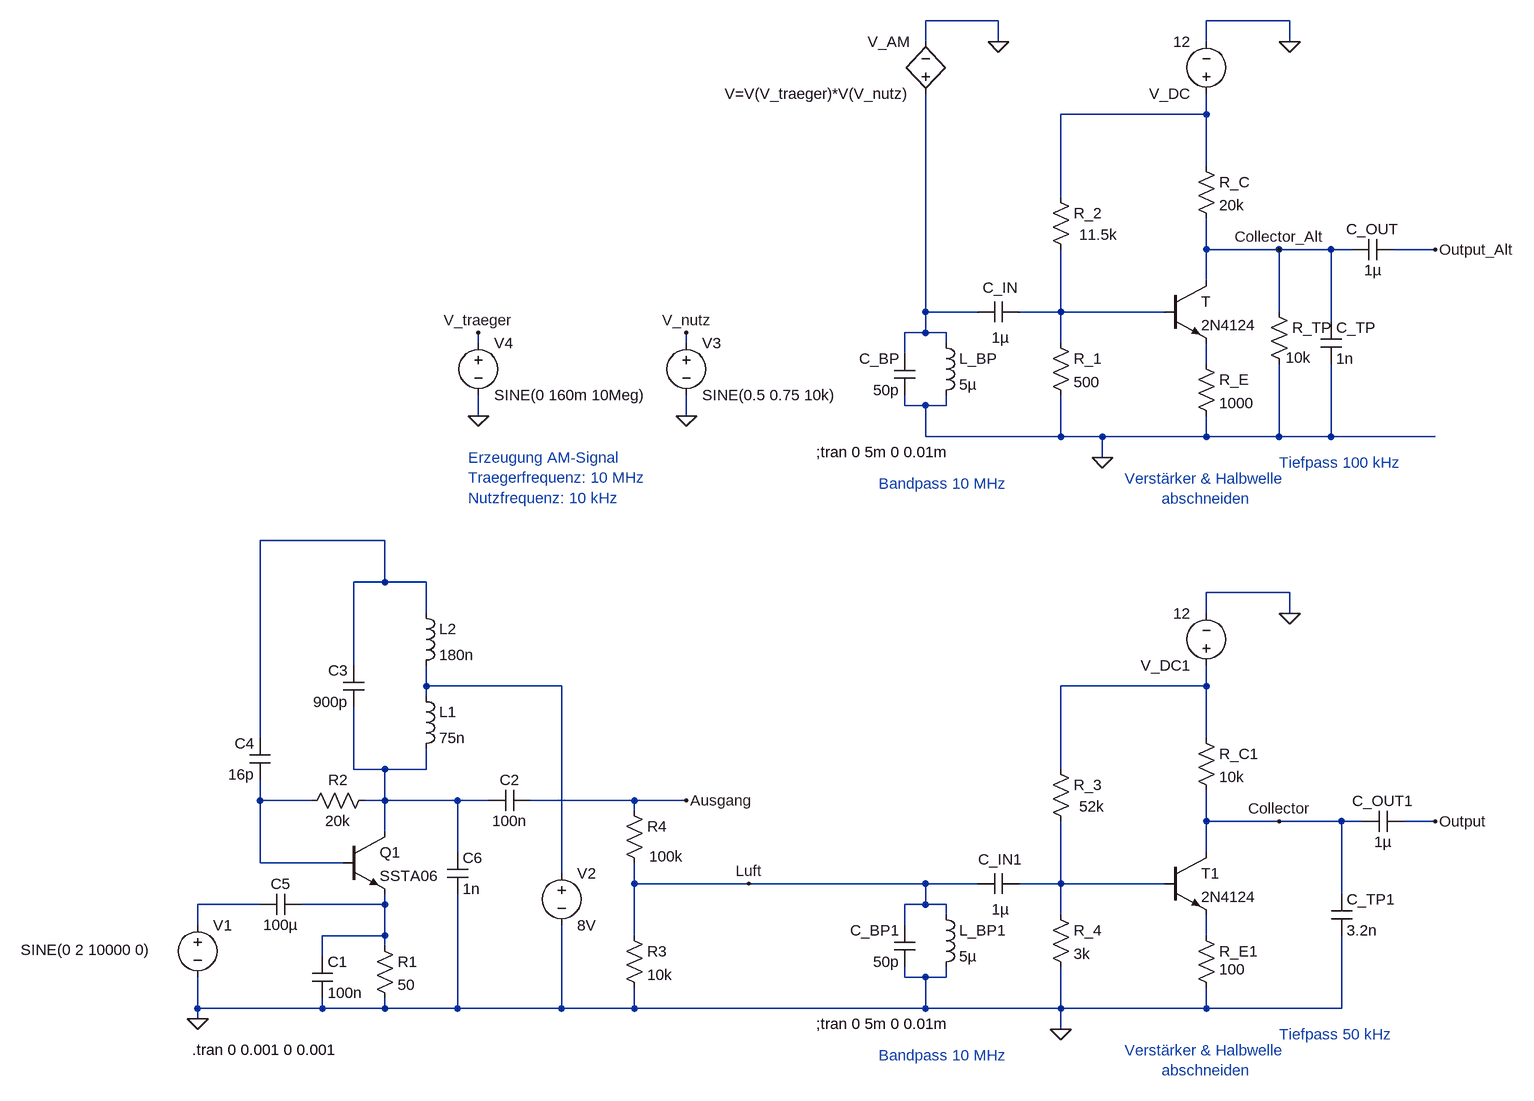
[diagram p0: schematic Empfaenger_Sender_AM_Modulation.asc]
Empfaenger_Sender_AM_Modulation.asc, the LTspice schematic file:
Version 4
SHEET 1 968 1520
WIRE -96 -304 -208 -304
WIRE 352 -304 224 -304
WIRE -208 -272 -208 -304
WIRE -96 -272 -96 -304
WIRE 224 -272 224 -304
WIRE 352 -272 352 -304
WIRE 224 -160 224 -192
WIRE 224 -160 0 -160
WIRE 224 -80 224 -160
WIRE 0 -32 0 -160
WIRE 224 48 224 0
WIRE 336 48 224 48
WIRE 416 48 336 48
WIRE 448 48 416 48
WIRE 576 48 512 48
WIRE 224 96 224 48
WIRE -208 144 -208 -192
WIRE -128 144 -208 144
WIRE 0 144 0 48
WIRE 0 144 -64 144
WIRE 160 144 0 144
WIRE 336 144 336 48
WIRE 416 160 416 48
WIRE -208 176 -208 144
WIRE -208 176 -240 176
WIRE -176 176 -208 176
WIRE -896 192 -896 176
WIRE -576 192 -576 176
WIRE -176 192 -176 176
WIRE 0 192 0 144
WIRE -240 208 -240 176
WIRE 224 224 224 192
WIRE -240 288 -240 272
WIRE -208 288 -240 288
WIRE -176 288 -176 272
WIRE -176 288 -208 288
WIRE -896 304 -896 272
WIRE -576 304 -576 272
WIRE -208 336 -208 288
WIRE 0 336 0 272
WIRE 0 336 -208 336
WIRE 64 336 0 336
WIRE 224 336 224 304
WIRE 224 336 64 336
WIRE 336 336 336 224
WIRE 336 336 224 336
WIRE 416 336 416 224
WIRE 416 336 336 336
WIRE 576 336 416 336
WIRE 64 368 64 336
WIRE -1040 496 -1232 496
WIRE -1040 560 -1040 496
WIRE -1040 560 -1088 560
WIRE -976 560 -1040 560
WIRE 352 576 224 576
WIRE -976 608 -976 560
WIRE 224 608 224 576
WIRE 352 608 352 576
WIRE -1088 688 -1088 560
WIRE -976 720 -976 688
WIRE -768 720 -976 720
WIRE 224 720 224 688
WIRE 224 720 0 720
WIRE -976 736 -976 720
WIRE -1232 800 -1232 496
WIRE 224 800 224 720
WIRE -1088 848 -1088 752
WIRE -1040 848 -1088 848
WIRE -976 848 -976 816
WIRE -976 848 -1040 848
WIRE 0 848 0 720
WIRE -1232 896 -1232 864
WIRE -1152 896 -1232 896
WIRE -1040 896 -1040 848
WIRE -1040 896 -1072 896
WIRE -928 896 -1040 896
WIRE -880 896 -928 896
WIRE -656 896 -816 896
WIRE -576 896 -656 896
WIRE -656 912 -656 896
WIRE 224 928 224 880
WIRE 336 928 224 928
WIRE 432 928 336 928
WIRE 464 928 432 928
WIRE 576 928 528 928
WIRE -1040 944 -1040 896
WIRE -928 976 -928 896
WIRE 224 976 224 928
WIRE -1232 992 -1232 896
WIRE -1104 992 -1232 992
WIRE -768 1008 -768 720
WIRE -656 1024 -656 992
WIRE -480 1024 -656 1024
WIRE -208 1024 -480 1024
WIRE -128 1024 -208 1024
WIRE 0 1024 0 928
WIRE 0 1024 -64 1024
WIRE 160 1024 0 1024
WIRE 432 1040 432 928
WIRE -1232 1056 -1328 1056
WIRE -1040 1056 -1040 1040
WIRE -1040 1056 -1168 1056
WIRE -208 1056 -208 1024
WIRE -208 1056 -240 1056
WIRE -176 1056 -208 1056
WIRE -176 1072 -176 1056
WIRE 0 1072 0 1024
WIRE -1328 1088 -1328 1056
WIRE -240 1088 -240 1056
WIRE -1040 1104 -1040 1056
WIRE -1040 1104 -1136 1104
WIRE -656 1104 -656 1024
WIRE 224 1104 224 1072
WIRE -1040 1120 -1040 1104
WIRE -1136 1136 -1136 1104
WIRE -240 1168 -240 1152
WIRE -208 1168 -240 1168
WIRE -176 1168 -176 1152
WIRE -176 1168 -208 1168
WIRE -1328 1216 -1328 1168
WIRE -1136 1216 -1136 1200
WIRE -1136 1216 -1328 1216
WIRE -1040 1216 -1040 1200
WIRE -1040 1216 -1136 1216
WIRE -928 1216 -928 1040
WIRE -928 1216 -1040 1216
WIRE -768 1216 -768 1088
WIRE -768 1216 -928 1216
WIRE -656 1216 -656 1184
WIRE -656 1216 -768 1216
WIRE -208 1216 -208 1168
WIRE -208 1216 -656 1216
WIRE 0 1216 0 1152
WIRE 0 1216 -208 1216
WIRE 224 1216 224 1184
WIRE 224 1216 0 1216
WIRE 432 1216 432 1104
WIRE 432 1216 224 1216
WIRE -1328 1232 -1328 1216
WIRE 0 1248 0 1216
FLAG 64 368 0
FLAG 352 -272 0
FLAG -96 -272 0
FLAG -576 304 0
FLAG -896 304 0
FLAG -896 176 V_traeger
FLAG -576 176 V_nutz
FLAG 576 48 Output_Alt
FLAG 336 48 Collector_Alt
FLAG 0 1248 0
FLAG 352 608 0
FLAG 576 928 Output
FLAG 336 928 Collector
FLAG -1328 1232 0
FLAG -576 896 Ausgang
FLAG -480 1024 Luft
SYMBOL cap -224 272 R180
WINDOW 0 24 56 Left 2
WINDOW 3 24 8 Left 2
SYMATTR InstName C_BP
SYMATTR Value 50p
SYMBOL cap -128 160 R270
WINDOW 0 38 35 VTop 2
WINDOW 3 -8 35 VBottom 2
SYMATTR InstName C_IN
SYMATTR Value 1µ
SYMBOL res 208 -96 R0
SYMATTR InstName R_C
SYMATTR Value 20k
SYMBOL ind -192 176 R0
SYMATTR InstName L_BP
SYMATTR Value 5µ
SYMBOL npn 160 96 R0
SYMATTR InstName T
SYMATTR Value 2N4124
SYMBOL voltage 224 -176 R180
WINDOW 123 0 0 Left 0
WINDOW 39 0 0 Left 0
SYMATTR InstName V_DC
SYMATTR Value 12
SYMBOL res -16 -48 R0
WINDOW 3 44 73 Left 2
SYMATTR Value 11.5k
SYMATTR InstName R_2
SYMBOL res -16 176 R0
SYMATTR InstName R_1
SYMATTR Value 500
SYMBOL cap 512 32 R90
WINDOW 0 0 32 VBottom 2
WINDOW 3 32 32 VTop 2
SYMATTR InstName C_OUT
SYMATTR Value 1µ
SYMATTR SpiceLine V=0 Irms=0 Rser=0 Lser=0
SYMBOL voltage -576 176 R0
WINDOW 123 0 0 Left 0
WINDOW 39 0 0 Left 0
SYMATTR InstName V3
SYMATTR Value SINE(0.5 0.75 10k)
SYMBOL voltage -896 176 R0
WINDOW 123 0 0 Left 0
WINDOW 39 0 0 Left 0
SYMATTR InstName V4
SYMATTR Value SINE(0 160m 10Meg)
SYMBOL bv -208 -176 R180
WINDOW 0 24 96 Left 2
WINDOW 3 24 16 Left 2
SYMATTR InstName V_AM
SYMATTR Value V=V(V_traeger)*V(V_nutz)
SYMBOL cap 400 160 R0
SYMATTR InstName C_TP
SYMATTR Value 1n
SYMBOL res 320 128 R0
WINDOW 3 26 86 Left 2
SYMATTR Value 10k
SYMATTR InstName R_TP
SYMBOL res 208 208 R0
SYMATTR InstName R_E
SYMATTR Value 1000
SYMBOL cap -224 1152 R180
WINDOW 0 24 56 Left 2
WINDOW 3 24 8 Left 2
SYMATTR InstName C_BP1
SYMATTR Value 50p
SYMBOL cap -128 1040 R270
WINDOW 0 38 35 VTop 2
WINDOW 3 -8 35 VBottom 2
SYMATTR InstName C_IN1
SYMATTR Value 1µ
SYMBOL res 208 784 R0
SYMATTR InstName R_C1
SYMATTR Value 10k
SYMBOL ind -192 1056 R0
SYMATTR InstName L_BP1
SYMATTR Value 5µ
SYMBOL npn 160 976 R0
SYMATTR InstName T1
SYMATTR Value 2N4124
SYMBOL voltage 224 704 R180
WINDOW 123 0 0 Left 0
WINDOW 39 0 0 Left 0
SYMATTR InstName V_DC1
SYMATTR Value 12
SYMBOL res -16 832 R0
WINDOW 3 44 73 Left 2
SYMATTR Value 52k
SYMATTR InstName R_3
SYMBOL res -16 1056 R0
SYMATTR InstName R_4
SYMATTR Value 3k
SYMBOL cap 528 912 R90
WINDOW 0 0 32 VBottom 2
WINDOW 3 32 32 VTop 2
SYMATTR InstName C_OUT1
SYMATTR Value 1µ
SYMATTR SpiceLine V=0 Irms=0 Rser=0 Lser=0
SYMBOL cap 416 1040 R0
SYMATTR InstName C_TP1
SYMATTR Value 3.2n
SYMBOL res 208 1088 R0
WINDOW 3 36 68 Left 2
SYMATTR InstName R_E1
SYMATTR Value 100
SYMBOL res -1056 1104 R0
SYMATTR InstName R1
SYMATTR Value 50
SYMBOL cap -1152 1136 R0
SYMATTR InstName C1
SYMATTR Value 100n
SYMBOL res -1056 880 R90
WINDOW 0 0 56 VBottom 2
WINDOW 3 32 56 VTop 2
SYMATTR InstName R2
SYMATTR Value 20k
SYMBOL cap -816 880 R90
WINDOW 0 0 32 VBottom 2
WINDOW 3 32 32 VTop 2
SYMATTR InstName C2
SYMATTR Value 100n
SYMBOL cap -1072 752 R180
WINDOW 0 24 56 Left 2
WINDOW 3 24 8 Left 2
SYMATTR InstName C3
SYMATTR Value 900p
SYMBOL cap -1216 864 R180
WINDOW 0 24 56 Left 2
WINDOW 3 24 8 Left 2
SYMATTR InstName C4
SYMATTR Value 16p
SYMBOL cap -1232 1072 R270
WINDOW 0 32 32 VTop 2
WINDOW 3 0 32 VBottom 2
SYMATTR InstName C5
SYMATTR Value 100µ
SYMBOL ind -992 720 R0
SYMATTR InstName L1
SYMATTR Value 75n
SYMBOL ind -992 592 R0
SYMATTR InstName L2
SYMATTR Value 180n
SYMBOL voltage -1328 1072 R0
WINDOW 123 0 0 Left 0
WINDOW 39 0 0 Left 0
WINDOW 3 -272 54 Left 2
SYMATTR Value SINE(0 2 10000 0)
SYMATTR InstName V1
SYMBOL voltage -768 992 R0
WINDOW 123 0 0 Left 0
WINDOW 39 0 0 Left 0
SYMATTR InstName V2
SYMATTR Value 8V
SYMBOL npn -1104 944 R0
SYMATTR InstName Q1
SYMATTR Value SSTA06
SYMBOL cap -944 976 R0
SYMATTR InstName C6
SYMATTR Value 1n
SYMBOL res -672 1088 R0
SYMATTR InstName R3
SYMATTR Value 10k
SYMBOL res -672 896 R0
WINDOW 3 39 86 Left 2
SYMATTR Value 100k
SYMATTR InstName R4
TEXT -376 360 Left 2 !;tran 0 5m 0 0.01m
TEXT 336 376 Left 2 ;Tiefpass 100 kHz
TEXT -280 408 Left 2 ;Bandpass 10 MHz
TEXT 224 416 Center 2 ;Verstärker & Halbwelle \nabschneiden
TEXT -912 368 Left 2 ;Erzeugung AM-Signal\nTraegerfrequenz: 10 MHz\nNutzfrequenz: 10 kHz
TEXT -376 1240 Left 2 !;tran 0 5m 0 0.01m
TEXT 336 1256 Left 2 ;Tiefpass 50 kHz
TEXT -280 1288 Left 2 ;Bandpass 10 MHz
TEXT 224 1296 Center 2 ;Verstärker & Halbwelle \nabschneiden
TEXT -1336 1280 Left 2 !.tran 0 0.001 0 0.001

The netlist it stands for:
* Empfaenger_Sender_AM_Modulation.asc
C_BP 0 N002 50p
C_IN N002 N003 1µ
R_C N001 Collector_Alt 20k
L_BP N002 0 5µ
Q§T Collector_Alt N003 N004 0 2N4124
V_DC N001 0 12
R_2 N001 N003 11.5k
R_1 N003 0 500
C_OUT Output_Alt Collector_Alt 1µ V=0 Irms=0 Rser=0 Lser=0
V3 V_nutz 0 SINE(0.5 0.75 10k)
V4 V_traeger 0 SINE(0 160m 10Meg)
B§V_AM N002 0 V=V(V_traeger)*V(V_nutz)
C_TP Collector_Alt 0 1n
R_TP Collector_Alt 0 10k
R_E N004 0 1000
C_BP1 0 Luft 50p
C_IN1 Luft N010 1µ
R_C1 N007 Collector 10k
L_BP1 Luft 0 5µ
Q§T1 Collector N010 N013 0 2N4124
V_DC1 N007 0 12
R_3 N007 N010 52k
R_4 N010 0 3k
C_OUT1 Output Collector 1µ V=0 Irms=0 Rser=0 Lser=0
C_TP1 Collector 0 3.2n
R_E1 N013 0 100
R1 N012 0 50
C1 N012 0 100n
R2 N008 N009 20k
C2 Ausgang N008 100n
C3 N008 N005 900p
C4 N009 N005 16p
C5 N011 N012 100µ
L1 N006 N008 75n
L2 N005 N006 180n
V1 N011 0 SINE(0 2 10000 0)
V2 N006 0 8V
Q1 N008 N009 N012 0 SSTA06
C6 N008 0 1n
R3 Luft 0 10k
R4 Ausgang Luft 100k
.model NPN NPN
.model PNP PNP
.lib standard.bjt
;tran 0 5m 0 0.01m
* Tiefpass 100 kHz
* Bandpass 10 MHz
* Verstärker & Halbwelle
* abschneiden
* Erzeugung AM-Signal
* Traegerfrequenz: 10 MHz
* Nutzfrequenz: 10 kHz
;tran 0 5m 0 0.01m
* Tiefpass 50 kHz
* Bandpass 10 MHz
* Verstärker & Halbwelle
* abschneiden
.tran 0 0.001 0 0.001
.backanno
.end